# EAGLE design Commandes (EAGLE 9.3.2)
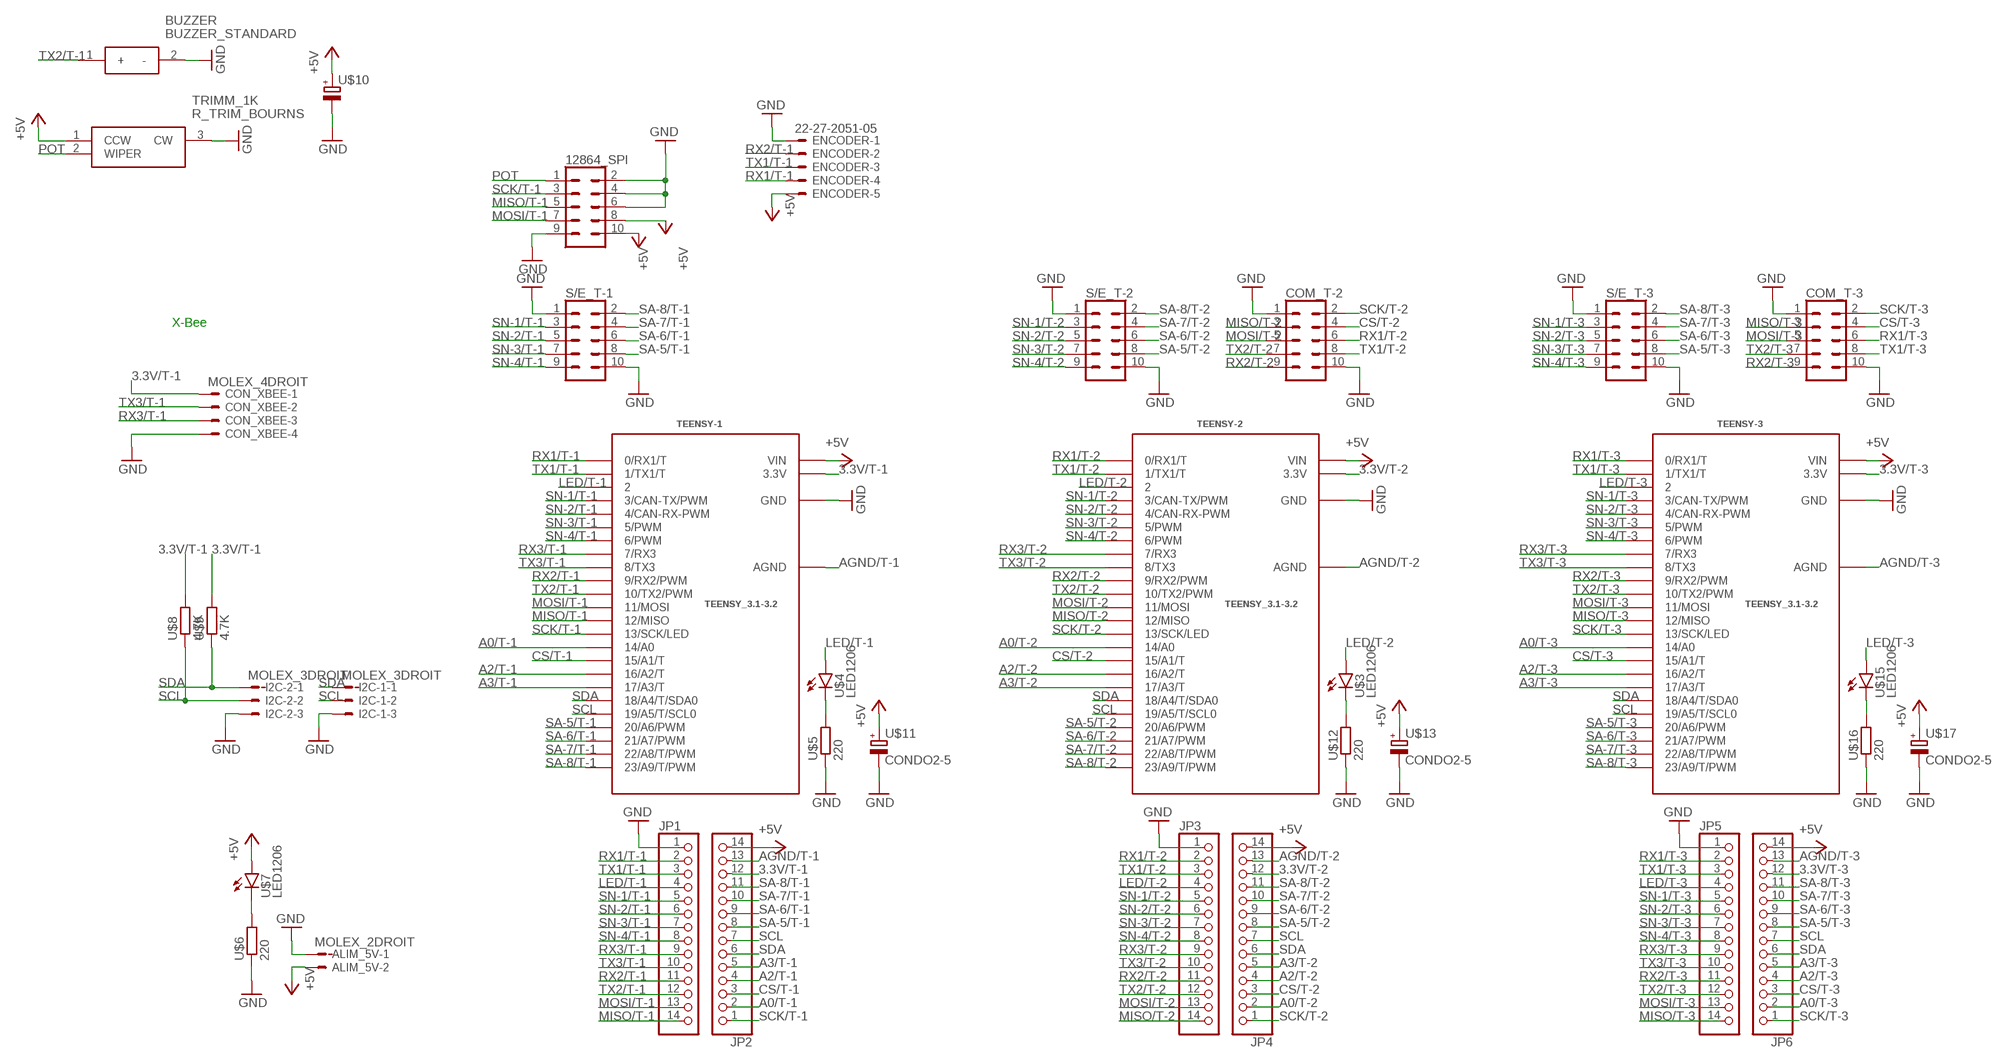
[diagram p0: schematic, sheet 1]

## Parts
12864_SPI  CON_5X2SHD  [2X5-SHROUDED]
ALIM_5V  MOLEX_2DROIT  [CON_2_DROIT]
BUZZER  BUZZER_STANDARD  [CEM-1203(42)]
COM_T-2  CON_5X2SHD  [2X5-SHROUDED]
COM_T-3  CON_5X2SHD  [2X5-SHROUDED]
CON_XBEE  MOLEX_4DROIT  [CON_4_DROIT]
ENCODER  22-27-2051-05  [6410-05]
I2C-1  MOLEX_3DROIT  [CON_3_DROIT]
I2C-2  MOLEX_3DROIT  [CON_3_DROIT]
JP1  PINHD-1X14_2.54  [1X14]
JP2  PINHD-1X14_2.54  [1X14]
JP3  PINHD-1X14_2.54  [1X14]
JP4  PINHD-1X14_2.54  [1X14]
JP5  PINHD-1X14_2.54  [1X14]
JP6  PINHD-1X14_2.54  [1X14]
S/E_T-1  CON_5X2SHD  [2X5-SHROUDED]
S/E_T-2  CON_5X2SHD  [2X5-SHROUDED]
S/E_T-3  CON_5X2SHD  [2X5-SHROUDED]
TEENSY-1  TEENSY_3.1-3.2  [TEENSY_3.0-3.2&LC_OUTER_ROW]
TEENSY-2  TEENSY_3.1-3.2  [TEENSY_3.0-3.2&LC_OUTER_ROW]
TEENSY-3  TEENSY_3.1-3.2  [TEENSY_3.0-3.2&LC_OUTER_ROW]
TRIMM_1K  R_TRIM_BOURNS  [3362P_1]
U$3  LED1206  [1206]
U$4  LED1206  [1206]
U$5  220  R1206R1206  [R1206]
U$6  220  R1206R1206  [R1206]
U$7  LED1206  [1206]
U$8  4.7K  R1206R1206  [R1206]
U$9  4.7K  R1206R1206  [R1206]
U$10  CONDO2-5  [E2-5]
U$11  CONDO2-5  [E2-5]
U$12  220  R1206R1206  [R1206]
U$13  CONDO2-5  [E2-5]
U$15  LED1206  [1206]
U$16  220  R1206R1206  [R1206]
U$17  CONDO2-5  [E2-5]

## Nets
3.3V/T-1: CON_XBEE.1 JP2.12 TEENSY-1.3.3V U$8.2 U$9.2
3.3V/T-2: JP4.12 TEENSY-2.3.3V
3.3V/T-3: JP6.12 TEENSY-3.3.3V
+5V: 12864_SPI.8 12864_SPI.10 ALIM_5V.2 ENCODER.5 JP2.14 JP4.14 JP6.14 TEENSY-1.V_IN(VIN) TEENSY-2.V_IN(VIN) TEENSY-3.V_IN(VIN) TRIMM_1K.1(CCW) U$7.A U$10.+ U$11.+ U$13.+ U$17.+
A0/T-1: JP2.2 TEENSY-1.14/A0
A0/T-2: JP4.2 TEENSY-2.14/A0
A0/T-3: JP6.2 TEENSY-3.14/A0
A2/T-1: JP2.4 TEENSY-1.16/A2(16/A2/T)
A2/T-2: JP4.4 TEENSY-2.16/A2(16/A2/T)
A2/T-3: JP6.4 TEENSY-3.16/A2(16/A2/T)
A3/T-1: JP2.5 TEENSY-1.17/A3(17/A3/T)
A3/T-2: JP4.5 TEENSY-2.17/A3(17/A3/T)
A3/T-3: JP6.5 TEENSY-3.17/A3(17/A3/T)
AGND/T-1: JP2.13 TEENSY-1.AGND
AGND/T-2: JP4.13 TEENSY-2.AGND
AGND/T-3: JP6.13 TEENSY-3.AGND
CS/T-1: JP2.3 TEENSY-1.15/A1(15/A1/T)
CS/T-2: COM_T-2.4 JP4.3 TEENSY-2.15/A1(15/A1/T)
CS/T-3: COM_T-3.4 JP6.3 TEENSY-3.15/A1(15/A1/T)
GND: 12864_SPI.2 12864_SPI.4 12864_SPI.6 12864_SPI.9 ALIM_5V.1 BUZZER.2(-) COM_T-2.1 COM_T-2.10 COM_T-3.1 COM_T-3.10 CON_XBEE.4 ENCODER.1 I2C-1.3 I2C-2.3 JP1.1 JP3.1 JP5.1 S/E_T-1.1 S/E_T-1.10 S/E_T-2.1 S/E_T-2.10 S/E_T-3.1 S/E_T-3.10 TEENSY-1.GND TEENSY-2.GND TEENSY-3.GND TRIMM_1K.3(CW) U$5.1 U$6.1 U$10.- U$11.- U$12.1 U$13.- U$16.1 U$17.-
LED/T-1: JP1.4 TEENSY-1.2 U$4.A
LED/T-2: JP3.4 TEENSY-2.2 U$3.A
LED/T-3: JP5.4 TEENSY-3.2 U$15.A
MISO/T-1: 12864_SPI.5 JP1.14 TEENSY-1.12(12/MISO)
MISO/T-2: COM_T-2.3 JP3.14 TEENSY-2.12(12/MISO)
MISO/T-3: COM_T-3.3 JP5.14 TEENSY-3.12(12/MISO)
MOSI/T-1: 12864_SPI.7 JP1.13 TEENSY-1.11(11/MOSI)
MOSI/T-2: COM_T-2.5 JP3.13 TEENSY-2.11(11/MOSI)
MOSI/T-3: COM_T-3.5 JP5.13 TEENSY-3.11(11/MOSI)
N$1: U$4.C U$5.2
N$2: U$3.C U$12.2
N$3: U$15.C U$16.2
N$9: U$6.2 U$7.C
POT: 12864_SPI.1 TRIMM_1K.2(WIPER)
RX1/T-1: ENCODER.4 JP1.2 TEENSY-1.0(0/RX1/T)
RX1/T-2: COM_T-2.6 JP3.2 TEENSY-2.0(0/RX1/T)
RX1/T-3: COM_T-3.6 JP5.2 TEENSY-3.0(0/RX1/T)
RX2/T-1: ENCODER.2 JP1.11 TEENSY-1.9(9/RX2/PWM)
RX2/T-2: COM_T-2.9 JP3.11 TEENSY-2.9(9/RX2/PWM)
RX2/T-3: COM_T-3.9 JP5.11 TEENSY-3.9(9/RX2/PWM)
RX3/T-1: CON_XBEE.3 JP1.9 TEENSY-1.7(7/RX3)
RX3/T-2: JP3.9 TEENSY-2.7(7/RX3)
RX3/T-3: JP5.9 TEENSY-3.7(7/RX3)
SA-5/T-1: JP2.8 S/E_T-1.8 TEENSY-1.20/A6(20/A6/PWM)
SA-5/T-2: JP4.8 S/E_T-2.8 TEENSY-2.20/A6(20/A6/PWM)
SA-5/T-3: JP6.8 S/E_T-3.8 TEENSY-3.20/A6(20/A6/PWM)
SA-6/T-1: JP2.9 S/E_T-1.6 TEENSY-1.21/A7(21/A7/PWM)
SA-6/T-2: JP4.9 S/E_T-2.6 TEENSY-2.21/A7(21/A7/PWM)
SA-6/T-3: JP6.9 S/E_T-3.6 TEENSY-3.21/A7(21/A7/PWM)
SA-7/T-1: JP2.10 S/E_T-1.4 TEENSY-1.22/A8(22/A8/T/PWM)
SA-7/T-2: JP4.10 S/E_T-2.4 TEENSY-2.22/A8(22/A8/T/PWM)
SA-7/T-3: JP6.10 S/E_T-3.4 TEENSY-3.22/A8(22/A8/T/PWM)
SA-8/T-1: JP2.11 S/E_T-1.2 TEENSY-1.23/A9(23/A9/T/PWM)
SA-8/T-2: JP4.11 S/E_T-2.2 TEENSY-2.23/A9(23/A9/T/PWM)
SA-8/T-3: JP6.11 S/E_T-3.2 TEENSY-3.23/A9(23/A9/T/PWM)
SCK/T-1: 12864_SPI.3 JP2.1 TEENSY-1.13(13/SCK/LED)
SCK/T-2: COM_T-2.2 JP4.1 TEENSY-2.13(13/SCK/LED)
SCK/T-3: COM_T-3.2 JP6.1 TEENSY-3.13(13/SCK/LED)
SCL: I2C-1.2 I2C-2.2 JP2.7 JP4.7 JP6.7 TEENSY-1.19/A5(19/A5/T/SCL0) TEENSY-2.19/A5(19/A5/T/SCL0) TEENSY-3.19/A5(19/A5/T/SCL0) U$8.1
SDA: I2C-1.1 I2C-2.1 JP2.6 JP4.6 JP6.6 TEENSY-1.18/A4(18/A4/T/SDA0) TEENSY-2.18/A4(18/A4/T/SDA0) TEENSY-3.18/A4(18/A4/T/SDA0) U$9.1
SN-1/T-1: JP1.5 S/E_T-1.3 TEENSY-1.3(3/CAN-TX/PWM)
SN-1/T-2: JP3.5 S/E_T-2.3 TEENSY-2.3(3/CAN-TX/PWM)
SN-1/T-3: JP5.5 S/E_T-3.3 TEENSY-3.3(3/CAN-TX/PWM)
SN-2/T-1: JP1.6 S/E_T-1.5 TEENSY-1.4(4/CAN-RX-PWM)
SN-2/T-2: JP3.6 S/E_T-2.5 TEENSY-2.4(4/CAN-RX-PWM)
SN-2/T-3: JP5.6 S/E_T-3.5 TEENSY-3.4(4/CAN-RX-PWM)
SN-3/T-1: JP1.7 S/E_T-1.7 TEENSY-1.5(5/PWM)
SN-3/T-2: JP3.7 S/E_T-2.7 TEENSY-2.5(5/PWM)
SN-3/T-3: JP5.7 S/E_T-3.7 TEENSY-3.5(5/PWM)
SN-4/T-1: JP1.8 S/E_T-1.9 TEENSY-1.6(6/PWM)
SN-4/T-2: JP3.8 S/E_T-2.9 TEENSY-2.6(6/PWM)
SN-4/T-3: JP5.8 S/E_T-3.9 TEENSY-3.6(6/PWM)
TX1/T-1: ENCODER.3 JP1.3 TEENSY-1.1(1/TX1/T)
TX1/T-2: COM_T-2.8 JP3.3 TEENSY-2.1(1/TX1/T)
TX1/T-3: COM_T-3.8 JP5.3 TEENSY-3.1(1/TX1/T)
TX2/T-1: BUZZER.1(+) JP1.12 TEENSY-1.10(10/TX2/PWM)
TX2/T-2: COM_T-2.7 JP3.12 TEENSY-2.10(10/TX2/PWM)
TX2/T-3: COM_T-3.7 JP5.12 TEENSY-3.10(10/TX2/PWM)
TX3/T-1: CON_XBEE.2 JP1.10 TEENSY-1.8(8/TX3)
TX3/T-2: JP3.10 TEENSY-2.8(8/TX3)
TX3/T-3: JP5.10 TEENSY-3.8(8/TX3)

## Notes on the sheet
- X-Bee

## Library data of the parts
12864_SPI COM_T-2 COM_T-3 S/E_T-1-S/E_T-3 = AREA:CON_5X2: Multi connection point. Often used as Generic Header-pin footprint for 0.1 inch spaced/style header connections For AVR SPI programming port, see special device with nice symbol: "AVR_SPI_PROG_5x2.dev" You can populate with any combo of single row headers, but if you'd like an exact match, check these: 2x5 AVR ICSP Male Header <https://www.sparkfun.com/products/778> (PRT-00778) 2x5 Pin Shrouded Header <https://www.sparkfun.com/products/8506> (PRT-08506) On any of the 0.1 inch spaced packages, you can populate with these: Break Away Headers - Straight <https://www.sparkfun.com/products/116> (PRT-00116) Break Away Male Headers - Right Angle <https://www.sparkfun.com/products/553> (PRT-00553) Female Headers <https://www.sparkfun.com/products/115> (PRT-00115) Break Away Headers - Machine Pin <https://www.sparkfun.com/products/117> (PRT-00117) Break Away Female Headers - Swiss Machine Pin <https://www.sparkfun.com/products/743> (PRT-00743) Special note: the shrouded connector mates well with our 5x2 ribbon cables: 2x5 Pin IDC Ribbon Cable <https://www.sparkfun.com/products/8535> (PRT-08535); PROD_ID: CONN-08671; SF_ID: PRT-08506
ALIM_5V = AREA:MOLEX_2: CONNECTOR wire to board 2.54 mm (.1 inch) pitch header; MF: MOLEX; OC_FARNELL: unknown; OC_NEWARK: unknown
BUZZER = AREA:BUZZER_STANDARD: Speakers & Transducers Buzzers Source: Datasheet <https://componentsearchengine.com/Datasheets/1/CEM-1203(42).pdf>; DESCRIPTION: Speakers & Transducers Buzzers; HEIGHT: mm; MANUFACTURER_NAME: CUI; MANUFACTURER_PART_NUMBER: CEM-1203(42)
CON_XBEE = AREA:MOLEX_4: CONNECTOR wire to board 2.54 mm (.1 inch) pitch header; MF: MOLEX; OC_FARNELL: unknown; OC_NEWARK: unknown
ENCODER = con-molex:22-?-05: CONNECTOR wire to board 2.54 mm (.1 inch) pitch header; MF: MOLEX; OC_FARNELL: unknown; OC_NEWARK: unknown
I2C-1 I2C-2 = AREA:MOLEX_3: CONNECTOR wire to board 2.54 mm (.1 inch) pitch header; MF: MOLEX; OC_FARNELL: unknown; OC_NEWARK: unknown
JP1-JP6 = pinhead-2:PINHD-1X14: PIN HEADER
TEENSY-1-TEENSY-3 = AREA:TEENSY_3.1-3.2: Footprint for Teensy 3.1 or 3.2 board using all pin connections on the outer perimeter
TRIMM_1K = AREA:R_TRIM_BOURNS: Bourns 3362P Series Through Hole Trimmer Resistor with Pin Terminations, 1k +/-10% 0.5W +/-100ppm/C Top Adjust Source: Datasheet <https://www.bourns.com/docs/Product-Datasheets/3362.pdf>; ALLIED_NUMBER: 70154048; ALLIED_PRICE-STOCK: https://www.alliedelec.com/bourns-3362p-1-102lf/70154048/; DESCRIPTION: Bourns 3362P Series Through Hole Trimmer Resistor with Pin Terminations, 1k +/-10% 0.5W +/-100ppm/C Top Adjust; HEIGHT: mm; MANUFACTURER_NAME: Bourns; MANUFACTURER_PART_NUMBER: 3362P-1-102LF; MOUSER_PART_NUMBER: 652-3362P-1-102LF; MOUSER_PRICE-STOCK: https://www.mouser.com/Search/Refine.aspx?Keyword=652-3362P-1-102LF; RS_PART_NUMBER: 1673252; RS_PRICE-STOCK: http://uk.rs-online.com/web/p/products/1673252
U$3 U$4 U$7 U$15 = AREA:LED1206
U$5 U$6 U$8 U$9 U$12 U$16 = AREA:R1206
U$10 U$11 U$13 U$17 = AREA:CONDO

## Board
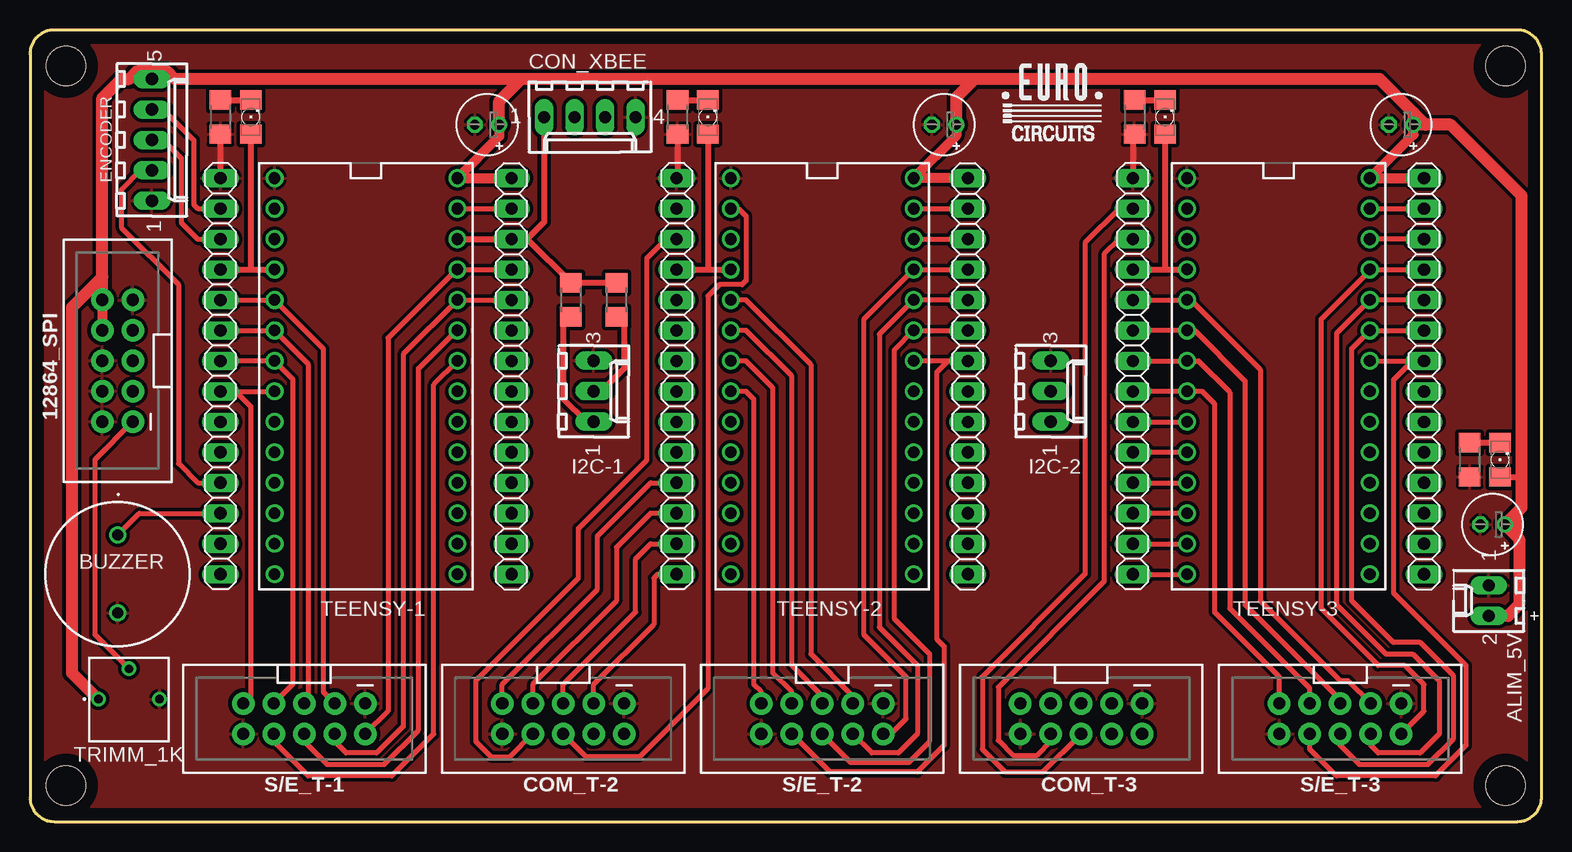
[diagram p1: board, top side]
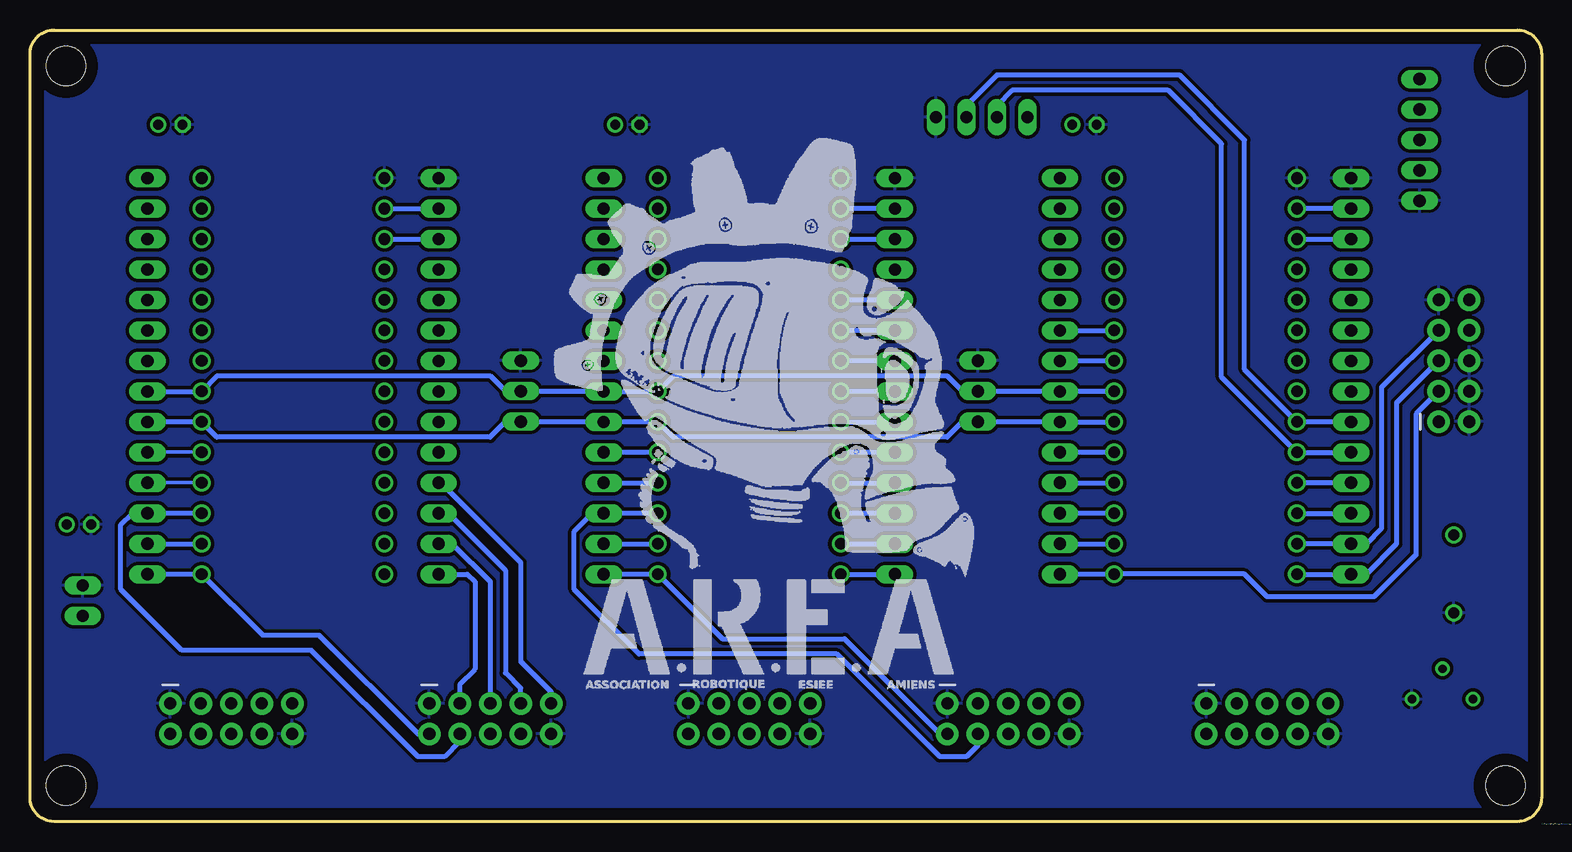
[diagram p2: board, bottom side, seen from below]

Size 126 x 66 mm. Coordinates in mm from the lower left corner, seen from the top.
Outline: 0,2 arc90 2,0 124,0 arc90 126,2 126,64 arc90 124,66 2,66 arc90 0,64 0,2
Copper layers (1*16): Top 0.035mm / dielectric 1.5mm / Bottom 0.035mm
Design rules "default *": minimum track width 12mil, minimum drill 0.35mm, track to track 12mil, track to pad 12mil, pad to pad 12mil, via to via 12mil, smd to smd 10mil, copper to edge 40mil, drill to drill 6mil, minimum pad ring 10mil, minimum via ring 8mil, stop-mask expansion 4mil, vias tented up to drill 0mil, thermal gap 10mil
Holes 3.3 mm at 3,63 123,3 3,3 123,63

### Footprints (pad centres in the part's own frame; a part is rotated, then mirrored left to right if it is on the bottom)
2X5-SHROUDED = drill 1.016 pad 1.88: 1 -1.27,5.08; 2 1.27,5.08; 3 -1.27,2.54; 4 1.27,2.54; 5 -1.27,0; 6 1.27,0; 7 -1.27,-2.54; 8 1.27,-2.54; 9 -1.27,-5.08; 10 1.27,-5.08
CON_2_DROIT = drill 1.016 long: 1 1.27,0; 2 -1.27,0
CEM-1203(42) = drill 0.9 pad 1.41: 1 -3.25,0; 2 3.25,0
CON_4_DROIT = drill 1.016 long: 1 3.81,0; 2 1.27,0; 3 -1.27,0; 4 -3.81,0
6410-05 = drill 1.016 long: 1 5.08,0; 2 2.54,0; 3 0,0; 4 -2.54,0; 5 -5.08,0
CON_3_DROIT = drill 1.016 long: 1 2.54,0; 2 0,0; 3 -2.54,0
1X14 = drill 1.016 long: 1 -16.51,0; 2 -13.97,0; 3 -11.43,0; 4 -8.89,0; 5 -6.35,0; 6 -3.81,0; 7 -1.27,0; 8 1.27,0; 9 3.81,0; 10 6.35,0; 11 8.89,0; 12 11.43,0; 13 13.97,0; 14 16.51,0
TEENSY_3.0-3.2&LC_OUTER_ROW = drill 0.965: 0 -7.62,13.97; 1 -7.62,11.43; 2 -7.62,8.89; 3 -7.62,6.35; 3.3V 7.62,11.43; 4 -7.62,3.81; 5 -7.62,1.27; 6 -7.62,-1.27; 7 -7.62,-3.81; 8 -7.62,-6.35; 9 -7.62,-8.89; 10 -7.62,-11.43; 11 -7.62,-13.97; 12 -7.62,-16.51; 13 7.62,-16.51; 14/A0 7.62,-13.97; 15/A1 7.62,-11.43; 16/A2 7.62,-8.89; 17/A3 7.62,-6.35; 18/A4 7.62,-3.81; 19/A5 7.62,-1.27; 20/A6 7.62,1.27; 21/A7 7.62,3.81; 22/A8 7.62,6.35; 23/A9 7.62,8.89; AGND 7.62,13.97; GND -7.62,16.51; V_IN 7.62,16.51
3362P_1 = drill 0.69 pad 1.12: 1 -2.54,3.53; 2 0,6.07; 3 2.54,3.53
1206 = smd 1.6 x 1.803: A -1.422,0; C 1.422,0
R1206 = smd 1.6 x 1.803: 1 -1.422,0; 2 1.422,0
E2-5 = drill 0.813 pad 1.27: + -1.016,0 | drill 0.813 pad 1.27 octagon: - 1.016,0

### Placement (x,y rotation side)
12864_SPI  7.3,38.42 180 top
ALIM_5V  121.6,18.41 90 top
BUZZER  7.3,20.64 270 top
COM_T-2  44.45,8.57 270 top
COM_T-3  87.63,8.57 270 top
CON_XBEE  46.67,58.74 180 top
ENCODER  10.16,56.83 270 top
I2C-1  46.99,35.88 270 top
I2C-2  85.09,35.88 270 top
JP1  15.88,37.13 270 top
JP2  40.14,37.13 90 top
JP3  53.91,37.13 270 top
JP4  78.17,37.13 90 top
JP5  91.94,37.13 270 top
JP6  116.2,37.13 90 top
S/E_T-1  22.86,8.57 270 top
S/E_T-2  66.04,8.57 270 top
S/E_T-3  109.22,8.57 270 top
TEENSY-1  28.01,37.13 0 top
TEENSY-2  66.04,37.13 0 top
TEENSY-3  104.07,37.13 0 top
TRIMM_1K  8.26,6.67 0 top
U$3  56.52,58.74 90 top
U$4  18.41,58.74 90 top
U$5  15.88,58.74 90 top
U$6  120.02,30.16 90 top
U$7  122.56,30.16 90 top
U$8  48.9,43.5 90 top
U$9  45.09,43.5 90 top
U$10  76.2,58.1 180 top
U$11  38.1,58.1 180 top
U$12  53.98,58.74 90 top
U$13  114.3,58.1 180 top
U$15  94.61,58.74 90 top
U$16  92.08,58.74 90 top
U$17  121.92,24.77 180 top

### Tracks (layer width: path | path; a pad name or v marks a point on that pad's centre or on a via)
3.3V/T-1
  Top 0.508: U$8.2 U$9.2 41.44,48.56 | TEENSY-1.3.3V JP2.12 41.44,48.56 | CON_XBEE.1 42.86,49.99 41.44,48.56
3.3V/T-2
  Top 0.406: TEENSY-2.3.3V JP4.12
3.3V/T-3
  Top 0.406: JP6.12 TEENSY-3.3.3V
+5V
  Top 0.508: U$7.A 124.2,28.74 124.35,28.89
  Top 0.813: JP2.14 TEENSY-1.V_IN 39.12,57.13 U$11.+ | JP4.14 TEENSY-2.V_IN 77.22,57.2 U$10.+ | JP6.14 TEENSY-3.V_IN 115.32,57.27 U$13.+ | 12864_SPI.10 12864_SPI.8
  Top 1.016: 123.86,25.69 U$17.+ 123.86,23.84 | 123.86,25.69 124.35,26.18 124.35,28.89 124.35,52.18 118.43,58.1 116.32,58.1 | 116.32,58.1 U$13.+ 115.32,59.11 | 115.32,59.11 112.51,61.91 78.74,61.91 | 78.74,61.91 40.96,61.91 | 40.96,61.91 12.06,61.91 11.43,62.55 10.16,62.55 | U$11.+ 39.12,60.07 40.96,61.91 | U$10.+ 77.22,60.39 78.74,61.91 | 12864_SPI.10 6.03,45.4 | 6.03,45.4 6.03,60.33 7.62,61.91 8.26,61.91 8.89,62.55 10.16,62.55 | 6.03,45.4 3.49,42.86 3.49,12.38 5.7,10.18 TRIMM_1K.1 | 115.32,59.11 116.32,58.1 | ALIM_5V.2 123.19,17.14 124.14,18.1 124.14,23.56 123.86,23.84 | 123.86,25.69 123.86,23.84 | ENCODER.5 10.16,62.55
A0/T-1
  Bottom 0.406: JP2.2 TEENSY-1.14/A0
A0/T-2
  Bottom 0.406: JP4.2 TEENSY-2.14/A0
A0/T-3
  Bottom 0.406: JP6.2 TEENSY-3.14/A0
A2/T-1
  Bottom 0.406: JP2.4 TEENSY-1.16/A2
A2/T-2
  Bottom 0.406: JP4.4 TEENSY-2.16/A2
A2/T-3
  Bottom 0.305: TEENSY-3.16/A2 111.76,28.26 116.2,28.26 JP6.4
A3/T-1
  Bottom 0.406: TEENSY-1.17/A3 JP2.5
A3/T-2
  Bottom 0.406: TEENSY-2.17/A3 JP4.5
A3/T-3
  Bottom 0.305: TEENSY-3.17/A3 111.76,30.8 116.2,30.8 JP6.5
AGND/T-1
  Top 0.406: TEENSY-1.AGND JP2.13
AGND/T-2
  Top 0.406: TEENSY-2.AGND JP4.13
AGND/T-3
  Top 0.406: TEENSY-3.AGND JP6.13
CS/T-1
  Bottom 0.406: TEENSY-1.15/A1 JP2.3
CS/T-2
  Bottom 0.406: TEENSY-2.15/A1 JP4.3 79.13,25.7 80.64,24.19 80.64,19.37 75.25,13.97 58.74,13.97 50.16,5.4 47.94,5.4 46.99,6.35 COM_T-2.4
CS/T-3
  Bottom 0.406: TEENSY-3.15/A1 JP6.3 117.49,25.7 118.43,24.77 118.43,19.37 113.35,14.29 102.55,14.29 93.66,5.4 91.44,5.4 90.17,6.67 COM_T-3.4
GND
  Top 0.508: U$16.1 91.94,57.18 JP5.1 | U$12.1 53.98,53.72 JP3.1 | JP1.1 U$5.1
  pour Bottom: -16.19,75.88 135.89,75.88 135.89,-7.62 -16.19,-7.62
  pour Top: -22.86,74.58 -22.86,-9.53 137.16,-9.53 137.16,74.92
LED/T-1
  Top 0.508: JP1.4 18.41,46.02 | 18.41,46.02 TEENSY-1.2 | U$4.A 18.41,46.02
LED/T-2
  Top 0.508: JP3.4 56.52,46.02 | 56.52,46.02 TEENSY-2.2 | U$3.A 56.52,46.02
LED/T-3
  Top 0.508: JP5.4 94.61,46.02 | 94.61,46.02 TEENSY-3.2 | U$15.A 94.61,46.02
MISO/T-1
  Bottom 0.406: TEENSY-1.12 JP1.14 14.62,20.62 12.06,23.18 12.06,34.92 12864_SPI.5
MISO/T-2
  Top 0.406: COM_T-2.3 46.99,11.43 52,16.44 52,20.31 52.32,20.62 JP3.14
  Bottom 0.406: TEENSY-2.12 JP3.14
MISO/T-3
  Top 0.406: JP5.14 TEENSY-3.12
  Bottom 0.406: JP5.14 89.52,20.62 88.9,20 88.9,12.7 90.17,11.43 COM_T-3.3
MOSI/T-1
  Bottom 0.406: TEENSY-1.11 JP1.13 14.62,23.16 13.34,24.45 13.34,36.2 12864_SPI.7
MOSI/T-2
  Top 0.406: COM_T-2.5 44.45,11.43 50.48,17.46 50.48,21.91 51.75,23.18 51.77,23.16 JP3.13
  Bottom 0.406: TEENSY-2.11 JP3.13
MOSI/T-3
  Top 0.406: JP5.13 TEENSY-3.11
  Bottom 0.406: JP5.13 90.79,23.16 87.63,20 COM_T-3.5
N$1
  Top 0.508: U$5.2 U$4.C
N$2
  Top 0.508: U$12.2 U$3.C
N$3
  Top 0.508: U$16.2 U$15.C
N$9
  Top 0.508: U$6.2 U$7.C
POT
  Top 0.406: TRIMM_1K.2 5.4,15.6 5.4,30.16 12864_SPI.1
RX1/T-1
  Top 0.406: ENCODER.4 11.11,59.37 13.65,56.83 13.65,51.44 13.98,51.1 JP1.2
  Bottom 0.406: JP1.2 TEENSY-1.0
RX1/T-2
  Top 0.406: TEENSY-2.0 59.04,51.1 59.05,51.12 59.69,50.48 59.69,45.09 59.37,44.77 57.47,44.77 56.52,43.81 56.52,11.11 50.8,5.4 46.35,5.4 COM_T-2.6
  Bottom 0.406: JP3.2 TEENSY-2.0
RX1/T-3
  Top 0.406: JP5.2 90.79,51.1 87.95,48.26 87.95,20.64 79.38,12.06 79.38,6.03 81.28,4.13 84.45,4.13 COM_T-3.6
  Bottom 0.406: TEENSY-3.0 JP5.2
RX2/T-1
  Top 0.406: JP1.11 13.98,28.25 12.38,29.84 12.38,44.77 7.62,49.53 7.62,52.7 9.21,54.29 ENCODER.2
  Bottom 0.406: JP1.11 TEENSY-1.9
RX2/T-2
  Top 0.406: COM_T-2.9 39.37,11.43 47.31,19.37 47.31,23.81 51.74,28.25 JP3.11
  Bottom 0.406: TEENSY-2.9 JP3.11
RX2/T-3
  Top 0.406: JP5.11 TEENSY-3.9
  Bottom 0.406: COM_T-3.9 82.55,10.79 85.09,13.34 85.09,21.59 91.62,28.12 91.81,28.12 JP5.11
RX3/T-1
  Bottom 0.406: JP1.9 TEENSY-1.7 24.77,37.7 24.77,56.83 30.16,62.23 45.4,62.23 47.94,59.69 CON_XBEE.3
RX3/T-2
  Bottom 0.406: TEENSY-2.7 JP3.9
RX3/T-3
  Top 0.406: JP5.9 TEENSY-3.7
SA-5/T-1
  Top 0.406: S/E_T-1.8 20.32,6.67 23.18,3.81 30.16,3.81 33.66,7.3 33.66,36.43 TEENSY-1.20/A6
  Bottom 0.406: TEENSY-1.20/A6 JP2.8
SA-5/T-2
  Top 0.406: JP4.8 76.52,38.41 | 76.52,38.41 TEENSY-2.20/A6 | 76.52,38.41 75.56,37.45 75.56,15.24 76.2,14.61 76.2,6.35 73.98,4.13 66.67,4.13 S/E_T-2.8
SA-5/T-3
  Top 0.406: TEENSY-3.20/A6 JP6.8 115.24,38.41 113.67,36.83 113.67,19.05 119.7,13.02 119.7,6.35 117.16,3.81 108.9,3.81 106.68,6.03 S/E_T-3.8
SA-6/T-1
  Top 0.406: S/E_T-1.6 22.86,6.67 24.77,4.76 29.53,4.76 32.38,7.62 32.38,37.78 35.55,40.95 TEENSY-1.21/A7
  Bottom 0.406: JP2.9 TEENSY-1.21/A7
SA-6/T-2
  Top 0.406: S/E_T-2.6 68.41,4.94 73.25,4.94 75.01,6.69 75.01,13.95 72.07,16.88 72.07,39.37 72.08,39.37 TEENSY-2.21/A7 JP4.9
SA-6/T-3
  Top 0.406: JP6.9 TEENSY-3.21/A7 110.17,39.43 110.17,18.41 113.67,14.92 115.89,14.92 118.67,12.14 118.67,6.91 116.52,4.76 110.81,4.76 109.22,6.35 S/E_T-3.6
SA-7/T-1
  Top 0.406: JP2.10 TEENSY-1.22/A8 31.11,38.97 31.11,7.94 28.89,5.71 26.35,5.71 25.4,6.67 S/E_T-1.4
SA-7/T-2
  Top 0.406: S/E_T-2.4 70.17,5.71 72.39,5.71 73.98,7.3 73.98,13.02 70.8,16.19 70.8,40.64 70.81,40.64 TEENSY-2.22/A8 JP4.10
SA-7/T-3
  Top 0.406: JP6.10 TEENSY-3.22/A8 108.9,40.7 108.9,18.1 113.03,13.97 115.25,13.97 117.47,11.75 117.47,7.3 115.89,5.71 112.39,5.71 111.76,6.35 S/E_T-3.4
SA-8/T-1
  Top 0.406: JP2.11 TEENSY-1.23/A9 35.55,46.02 29.84,40.32 29.84,9.21 S/E_T-1.2
SA-8/T-2
  Top 0.406: S/E_T-2.2 71.75,7.3 73.03,8.57 73.03,12.06 69.53,15.56 69.53,41.91 73.65,46.02 TEENSY-2.23/A9 JP4.11
SA-8/T-3
  Top 0.406: TEENSY-3.23/A9 111.76,46.02 | 111.76,46.02 JP6.11 | S/E_T-3.2 116.2,9.21 116.2,11.43 114.62,13.02 112.39,13.02 107.63,17.78 107.63,41.9 111.76,46.02
SCK/T-1
  Bottom 0.406: JP2.1 TEENSY-1.13 35.62,20.64 24.77,20.64 22.86,18.73 13.97,18.73 10.48,22.23 10.48,33.97 12864_SPI.3
SCK/T-2
  Bottom 0.406: JP4.1 TEENSY-2.13 68.28,15.24 58.1,15.24 50.16,7.3 COM_T-2.2
SCK/T-3
  Bottom 0.406: JP6.1 TEENSY-3.13 106.62,15.56 101.92,15.56 93.66,7.3 COM_T-3.2
SCL
  Top 0.508: U$8.1 49.53,41.44 49.53,37.78 47.62,35.88 I2C-1.2
  Bottom 0.406: TEENSY-1.19/A5 JP2.7 46.98,35.87 I2C-1.2 48.26,35.88 49.52,37.13 72.39,37.13 TEENSY-2.19/A5 JP4.7 85.08,35.87 I2C-2.2 86.36,35.88 87.62,37.13 110.42,37.13 TEENSY-3.19/A5 JP6.7
SDA
  Top 0.508: U$9.1 44.45,41.44 44.45,35.24 46.35,33.34 I2C-1.1
  Bottom 0.406: TEENSY-1.18/A4 JP2.6 40.16,33.34 I2C-1.1 48.26,33.34 49.54,32.05 72.39,32.05 TEENSY-2.18/A4 JP4.6 78.19,33.34 I2C-2.1 86.36,33.34 87.64,32.05 110.42,32.05 TEENSY-3.18/A4 JP6.6
SN-1/T-1
  Top 0.406: JP1.5 TEENSY-1.3 24.45,39.43 24.45,10.79 S/E_T-1.3
SN-1/T-2
  Top 0.406: TEENSY-2.3 59.68,43.48 59.69,43.5 65.09,38.1 65.09,13.97 68.58,10.48 S/E_T-2.3
  Bottom 0.406: JP3.5 TEENSY-2.3
SN-1/T-3
  Top 0.406: JP5.5 TEENSY-3.3 96.77,43.48 102.55,37.7 102.55,18.41 109.22,11.75 109.86,11.75 S/E_T-3.3
SN-2/T-1
  Top 0.406: JP1.6 TEENSY-1.4 23.18,38.16 23.18,10.16 S/E_T-1.5
SN-2/T-2
  Top 0.406: TEENSY-2.4 59.69,40.95 63.5,37.13 63.5,13.02 66.04,10.48 S/E_T-2.5
  Bottom 0.406: JP3.6 TEENSY-2.4
SN-2/T-3
  Top 0.406: JP5.6 TEENSY-3.4 97.08,40.95 101.28,36.75 101.28,18.1 109.22,10.16 S/E_T-3.5
SN-3/T-1
  Top 0.406: JP1.7 TEENSY-1.5 21.91,36.89 21.91,11.43 S/E_T-1.7
SN-3/T-2
  Top 0.406: S/E_T-2.7 63.5,10.79 61.91,12.38 61.91,36.18 59.69,38.41 TEENSY-2.5
  Bottom 0.406: JP3.7 TEENSY-2.5
SN-3/T-3
  Top 0.406: JP5.7 TEENSY-3.5 97.4,38.41 100.01,35.8 100.01,17.78 106.68,11.11 S/E_T-3.7
SN-4/T-1
  Top 0.406: TEENSY-1.6 JP1.8 17.16,35.87 18.41,34.61 18.41,10.48 S/E_T-1.9
SN-4/T-2
  Top 0.406: S/E_T-2.9 60.96,10.79 60.33,11.43 60.33,35.23 59.69,35.87 TEENSY-2.6
  Bottom 0.406: JP3.8 TEENSY-2.6
SN-4/T-3
  Top 0.406: JP5.8 TEENSY-3.6 97.72,35.87 98.74,34.84 98.74,17.46 104.14,12.06 S/E_T-3.9
TX1/T-1
  Top 0.406: ENCODER.3 11.11,56.83 12.62,55.32 12.62,49.92 13.97,48.58 15.86,48.58 JP1.3
  Bottom 0.406: TEENSY-1.1 JP1.3
TX1/T-2
  Top 0.406: COM_T-2.8 40.01,5.4 38.42,5.4 37.15,6.67 37.15,11.75 45.72,20.32 45.72,24.45 51.44,30.16 51.44,46.99 53.02,48.58 53.03,48.56 JP3.3
  Bottom 0.406: TEENSY-2.1 JP3.3
TX1/T-3
  Top 0.406: JP5.3 90.79,48.56 89.53,47.31 89.53,20 80.72,11.19 80.72,6.77 81.95,5.54 83.96,5.54 85.09,6.67 COM_T-3.8
  Bottom 0.406: TEENSY-3.1 JP5.3
TX2/T-1
  Top 0.406: BUZZER.1 9.12,25.7 JP1.12
  Bottom 0.406: TEENSY-1.10 JP1.12
TX2/T-2
  Top 0.406: JP3.12 51.77,25.7 51.75,25.72 48.9,22.86 48.9,18.41 41.91,11.43 COM_T-2.7
  Bottom 0.406: JP3.12 TEENSY-2.10
TX2/T-3
  Top 0.406: TEENSY-3.10 JP5.12
  Bottom 0.406: COM_T-3.7 85.09,11.11 86.36,12.38 86.36,20.95 91.11,25.7 JP5.12
TX3/T-1
  Bottom 0.406: JP1.10 TEENSY-1.8 26.67,37.06 26.67,56.52 31.11,60.96 44.13,60.96 45.4,59.69 CON_XBEE.2
TX3/T-2
  Bottom 0.406: JP3.10 TEENSY-2.8
TX3/T-3
  Top 0.406: TEENSY-3.8 JP5.10

### Text on the board
bPlace: C:/Users/alexp/Pictures/envers.bmp